# Altium schematic sheet Display.SchDoc
size A4; SheetNumber: 3; SheetTotal: 4
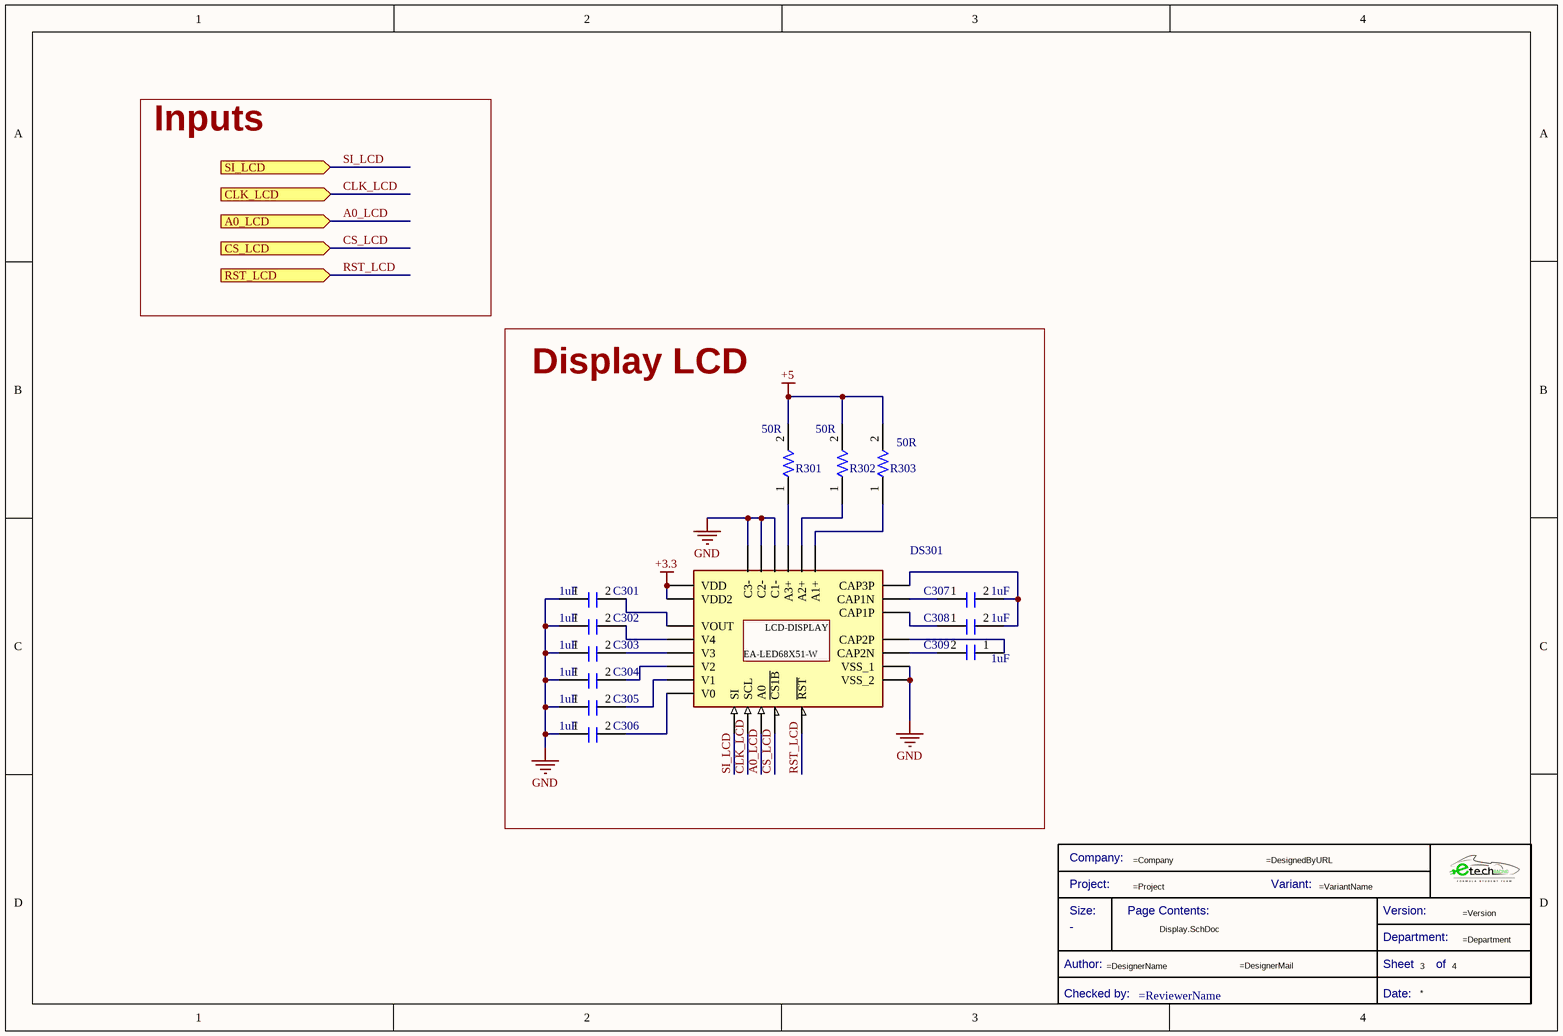
[diagram p0: Display.SchDoc]

## Parts
*  Title Block_template  (value not drawn)  (graphical)
C301  Capacitance: 1uF  [C0805FNPC-R]  (hidden comment: 885012207103)
C302  Capacitance: 1uF  [C0805FNPC-R]  (hidden comment: 885012207103)
C303  Capacitance: 1uF  [C0805FNPC-R]  (hidden comment: 885012207103)
C304  Capacitance: 1uF  [C0805FNPC-R]  (hidden comment: 885012207103)
C305  Capacitance: 1uF  [C0805FNPC-R]  (hidden comment: 885012207103)
C306  Capacitance: 1uF  [C0805FNPC-R]  (hidden comment: 885012207103)
C307  Capacitance: 1uF  [C0805FNPC-R]  (hidden comment: 885012207103)
C308  Capacitance: 1uF  [C0805FNPC-R]  (hidden comment: 885012207103)
C309  Capacitance: 1uF  [C0805FNPC-R]  (hidden comment: 885012207103)
DS301  EA_DOGL128W-6  [EA_DOGL128W-6]  (value not drawn)
R301  value 50R  [R0805FTK]  (hidden comment: CRCW080550R0FKTA)
R302  value 50R  [R0805FTK]  (hidden comment: CRCW080550R0FKTA)
R303  value 50R  [R0805FTK]  (hidden comment: CRCW080550R0FKTA)

## Blocks framed on the sheet
Display LCD: C301-C309 DS301 R301-R303

## Ports
A0_LCD (in, see DASHBOARD[1B]), CLK_LCD (in, see DASHBOARD[1B]), CS_LCD (in, see DASHBOARD[1B]), RST_LCD (in, see DASHBOARD[1C]), SI_LCD (in, see DASHBOARD[1B])

## Nets
+3.3: DS301.34(VDD2) DS301.35(VDD)
+5: R301.2 R302.2 R303.2
GND: C301.1 C302.1 C303.1 C304.1 C305.1 C306.1 DS301.18(C1-) DS301.19(C2-) DS301.20(C3-) DS301.26(VSS_1) DS301.33(VSS_2)
A0_LCD: DS301.38(A0) ; port A0_LCD
CLK_LCD: DS301.37(SCL) ; port CLK_LCD
CS_LCD: DS301.40(~{CS1B}) ; port CS_LCD
RST_LCD: DS301.39(~{RST}) ; port RST_LCD
SI_LCD: DS301.36(SI) ; port SI_LCD
NetC301_2: C301.2 DS301.32(VOUT)
NetC302_2: C302.2 DS301.25(V4)
NetC303_2: C303.2 DS301.24(V3)
NetC304_2: C304.2 DS301.23(V2)
NetC305_2: C305.2 DS301.22(V1)
NetC306_2: C306.2 DS301.21(V0)
NetC307_1: C307.1 DS301.30(CAP1N)
NetC307_2: C307.2 C308.2 DS301.31(CAP3P)
NetC308_1: C308.1 DS301.29(CAP1P)
NetC309_1: C309.1 DS301.28(CAP2P)
NetC309_2: C309.2 DS301.27(CAP2N)
NetDS301_1: DS301.1(A1+) R303.1
NetDS301_2: DS301.2(A2+) R302.1
NetDS301_3: DS301.3(A3+) R301.1

## Notes on the sheet
- Inputs
- (in symbol EA_DOGL128W-6) LCD-DISPLAY; EA-LED68X51-W
- (in symbol Title Block_template) Company:; Project:; Variant:; Size:; Page Contents:; Version:; Department:; Author:; Sheet; of; Checked by:; Date:

## Library data of the parts
* = Title Block_template: Standard Title Block; .Creator: GP; Category: Title Block; .PCBcheck: GP; .SCHcheck: GP; Checked by:: =ReviewerName; Size: -
C301-C309 = C1u-50V-0805FNPC-X7R: Multilayer Ceramic Capacitor, Wcap-Csgp Series, 1 F, 10%, X7R, 50 V, 0805 [2012 Metric] Rohs Compliant: Yes; Manufacturer 1: Wurth Electronics; Voltage Rating: 50V; .Creator: GP; Supplier 1: RSComponents; Manufacturer Part Number 1: 885012207103; RoHS: Yes; Category: Ceramic Capacitors; Stock 1: 5100; Pricing 1: 50=0,27200, 250=0,25300, 500=0,22800, 1250=0,20100, 2500=0,17100 (GBP); Mount: Surface Mount; Case/Package: 0805; Case Code (Metric): 2012; Case Code (Imperial): 0805; Min Operating Temperature: -55°C; Max Operating Temperature: 85°C; Packaging: Cut Tape; Dielectric: X7R; Tolerance: 10%; Voltage Rating (DC): 50V; Length: 0.079inch; Width: 0.049inch; Thickness: 0.053inch; REACH SVHC: Unknown; RoHS Compliant: Yes; ComponentLink1URL: http://www.farnell.com/datasheets/1958501.pdf?src-supplier=Farnell; ComponentLink1Description: http://www.farnell.com/datasheets/1958501.pdf?src-supplier=Farnell; ComponentLink2URL: http://www.farnell.com/datasheets/1958501.pdf?src-supplier=Element14; ComponentLink2Description: http://www.farnell.com/datasheets/1958501.pdf?src-supplier=Element14; ComponentLink3URL: https://katalog.we-online.de/pbs/datasheet/885012107003.pdf?src-supplier=Digi-Key; ComponentLink3Description: https://katalog.we-online.de/pbs/datasheet/885012107003.pdf?src-supplier=Digi-Key; ComponentLink4URL: http://www.farnell.com/datasheets/1958501.pdf?src-supplier=Newark; ComponentLink4Description: http://www.farnell.com/datasheets/1958501.pdf?src-supplier=Newark; Supplier Part Number 1: 1813523
DS301 = EA_DOGL128W-6: LCD Graphic Display Modules & Accessories FSTN (+) Transflectv White Background; Manufacturer_Name: Electronic Assembly GmbH; Manufacturer_Part_Number: EA DOGL128W-6; Manufacturer: Electronic Assembly; Manufacturer Part Number: EADOGL128W-6; Nominal Supply Current: 270uA; Resolution (height): 64pixel; Resolution (width): 128pixel; Interface: SPI; Viewing Area (width): 64mm; Viewing Area (height): 35mm; .Creator: GP; Height: 2.8mm; Category: Display; ComponentLink1Description: Datasheet; ComponentLink1URL: http://www.lcd-module.com/eng/pdf/grafik/dogl128-6e.pdf; ComponentLink2Description: Where buy it; ComponentLink2URL: *; Supplier 1: Digi-Key; RoHS: No; Min Operating Temperature: -20°C; Max Operating Temperature: 70°C; Package Quantity: 16; Illumination Color: White; Background Color: White; Width: 67.8mm; ComponentLink3URL: https://datasheet.ciiva.com/14100/dogl128-6-eng-tds-14100350.pdf?src-supplier=Distrelec; ComponentLink3Description: https://datasheet.ciiva.com/14100/dogl128-6-eng-tds-14100350.pdf?src-supplier=Distrelec; Supplier Part Number 1: 1481-1058-ND
R301-R303 = R50-0805FTK: Res Thick Film 0805 50 Ohm 1% 0.125W(1/8W) ±100ppm/C Pad SMD Automotive T/R; Manufacturer: Vishay Dale; Power Rating: 125mW; Voltage Rating: 150V; Temperature Coefficient: 100ppm/°C; Supplier 1: Mouser; Manufacturer Part Number: CRCW080550R0FKTA; RoHS: No; Category: Chip SMD Resistors; Stock 1: 38245; Pricing 1: 1=0,25, 10=0,204, 50=0,204, 100=0,08, 1000=0,033, 10000=0,026 (USD); Case/Package: 0805; Weight: 0.000194oz; Case Code (Imperial): 0805; Case Code (Metric): 2012; Contact Plating: Tin,Lead; Min Operating Temperature: -55°C; Max Operating Temperature: 155°C; Tolerance: 1%; Packaging: Tape and Reel; Package Quantity: 5000; Series: CRCW; Length: 2mm; Width: 1.25mm; Height: 0.45mm; Lead Free: Contains Lead; RoHS Compliant: No; ComponentLink1URL: https://datasheet.ciiva.com/48525/dcrcw-48525895.pdf?src-supplier=Avnet; ComponentLink1Description: https://datasheet.ciiva.com/48525/dcrcw-48525895.pdf?src-supplier=Avnet; Supplier Part Number 1: 71-CRCW0805-50